# Altium project Safety_2019_V_3_0.PrjPCB
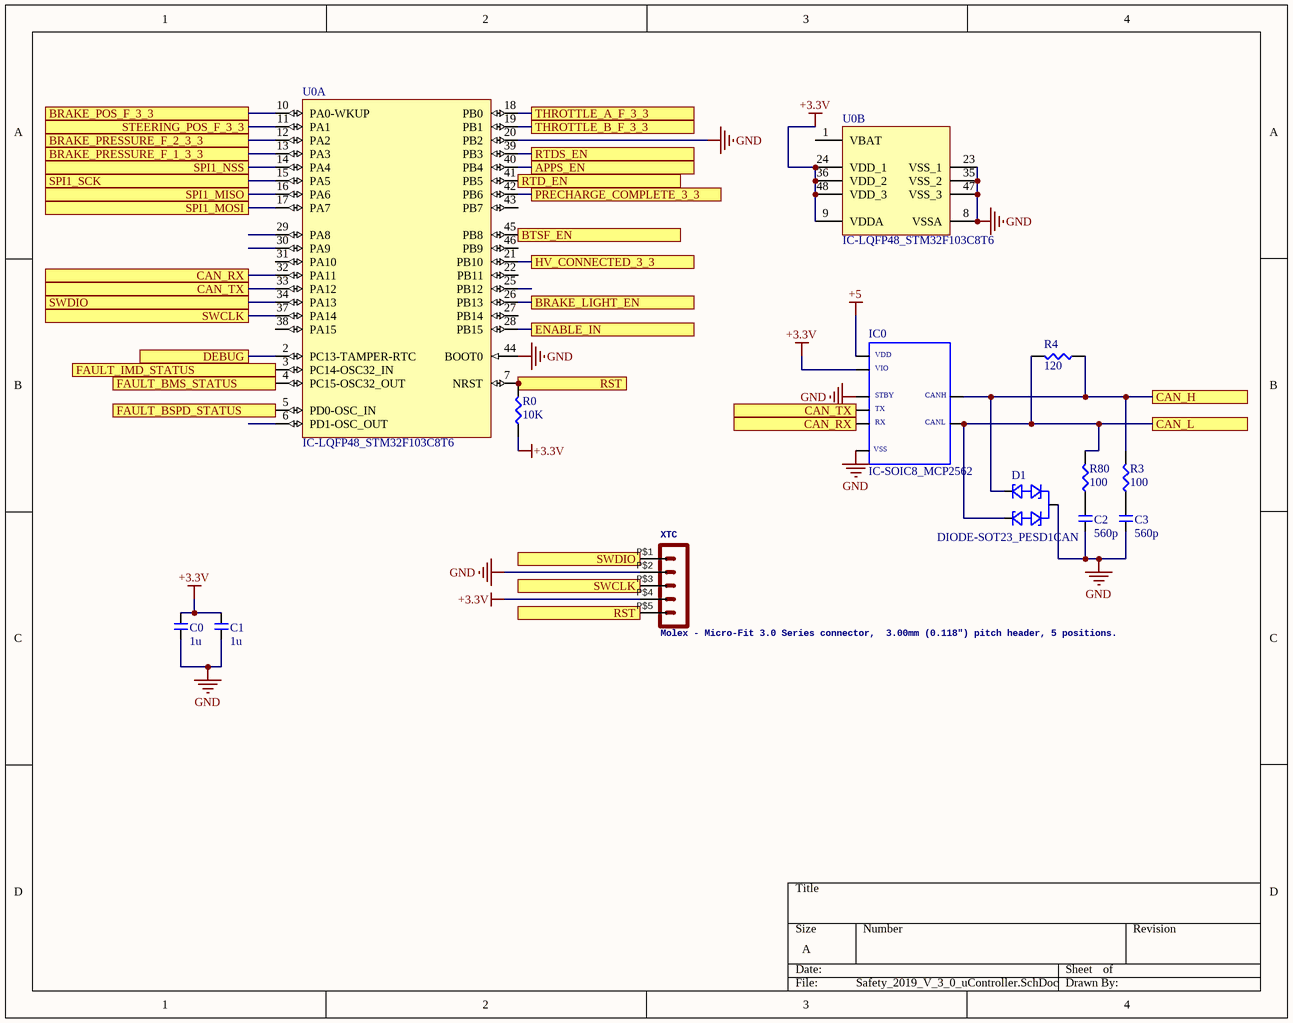
[diagram p0: Safety_2019_V_3_0_uController.SchDoc]
11 sheets, 222 parts. Net scope: flat (ports and power ports of the same name join across sheets).
Board file: SAFETY_2019_v_3_0.PcbDoc
Sheets:
  Safety_2019_V_3_0_uController.SchDoc
  Safety_2019_V_3_0_Faults.SchDoc
  Safety_2019_V_3_0_BSPD.SchDoc
  Safety_2019_V_3_0_BRAKE_LIGHT.SchDoc
  Safety_2019_V_3_0_TSAL.SchDoc
  Safety_2019_V_3_0_Power_IC's.SchDoc
  Safety_2019_V_3_0_Connectors.SchDoc
  Safety_2019_V_3_0_Connector_Filter.SchDoc
  Safety_2019_V_3_0_RTDS.SchDoc
  Safety_2019_V_3_0_Enable.SchDoc
  Safety_2019_V_3_0_TC.SchDoc

## Sheet Safety_2019_V_3_0_uController.SchDoc
size A

### Parts
C0  1u  [CAP-0603]
C1  1u  [CAP-0603]
C2  560p  [CAP-0603]
C3  560p  [CAP-0603]
D1  DIODE-SOT23_PESD1CAN  [SOT23]
IC0  IC-SOIC8_MCP2562  [SOIC8]
R0  10K  [RES-0603]
R3  100  [RES-0603]
R4  120  [RES-0603]
R80  100  [RES-0603]
U0  IC-LQFP48_STM32F103C8T6  [STM-LQFP48_M]  (parts A,B of 2)
XTC  Molex - Micro-Fit 3.0 Series connector,  3.00mm (0.118") pitch header, 5 positions.  [POS5_254MM_MALE]

### Ports
APPS_EN, BRAKE_LIGHT_EN, BRAKE_POS_F_3_3, BRAKE_PRESSURE_F_1_3_3, BRAKE_PRESSURE_F_2_3_3, BTSF_EN, CAN_H, CAN_L, CAN_RX, CAN_TX, DEBUG, ENABLE_IN, FAULT_BMS_STATUS, FAULT_BSPD_STATUS, FAULT_IMD_STATUS, HV_CONNECTED_3_3, PRECHARGE_COMPLETE_3_3, RST, RTD_EN, RTDS_EN, SPI1_MISO, SPI1_MOSI, SPI1_NSS, SPI1_SCK, STEERING_POS_F_3_3, SWCLK, SWDIO, THROTTLE_A_F_3_3, THROTTLE_B_F_3_3

### Nets
+3.3V: C0.2 C1.2 IC0.5 R0.1 U0.9(VDDA) U0.24(VDD_1) U0.36(VDD_2) U0.48(VDD_3) XTC.P$4
+5: IC0.3
GND: C0.1 C1.1 C2.1 C3.1 D1.3(G) IC0.2 IC0.8 U0.8(VSSA) U0.20(PB2) U0.23(VSS_1) U0.35(VSS_2) U0.44(BOOT0) U0.47(VSS_3) XTC.P$2
APPS_EN: U0.40(PB4) ; port APPS_EN
BRAKE_LIGHT_EN: U0.26(PB13) ; port BRAKE_LIGHT_EN
BRAKE_POS_F_3_3: U0.10(PA0-WKUP) ; port BRAKE_POS_F_3_3
BRAKE_PRESSURE_F_1_3_3: U0.13(PA3) ; port BRAKE_PRESSURE_F_1_3_3
BRAKE_PRESSURE_F_2_3_3: U0.12(PA2) ; port BRAKE_PRESSURE_F_2_3_3
BTSF_EN: U0.45(PB8) ; port BTSF_EN
CAN_H: D1.1(CAN1) IC0.7 R3.2 R4.1 ; port CAN_H
CAN_L: D1.2(CAN2) IC0.6 R4.2 R80.2 ; port CAN_L
CAN_RX: IC0.4 U0.32(PA11) ; port CAN_RX
CAN_TX: IC0.1 U0.33(PA12) ; port CAN_TX
DEBUG: U0.2(PC13-TAMPER-RTC) ; port DEBUG
ENABLE_IN: U0.28(PB15) ; port ENABLE_IN
FAULT_BMS_STATUS: U0.4(PC15-OSC32_OUT) ; port FAULT_BMS_STATUS
FAULT_BSPD_STATUS: U0.5(PD0-OSC_IN) ; port FAULT_BSPD_STATUS
FAULT_IMD_STATUS: U0.3(PC14-OSC32_IN) ; port FAULT_IMD_STATUS
HV_CONNECTED_3_3: U0.21(PB10) ; port HV_CONNECTED_3_3
PRECHARGE_COMPLETE_3_3: U0.42(PB6) ; port PRECHARGE_COMPLETE_3_3
RST: R0.2 U0.7(NRST) XTC.P$5 ; port RST
RTD_EN: U0.41(PB5) ; port RTD_EN
RTDS_EN: U0.39(PB3) ; port RTDS_EN
SPI1_MISO: U0.16(PA6) ; port SPI1_MISO
SPI1_MOSI: U0.17(PA7) ; port SPI1_MOSI
SPI1_NSS: U0.14(PA4) ; port SPI1_NSS
SPI1_SCK: U0.15(PA5) ; port SPI1_SCK
STEERING_POS_F_3_3: U0.11(PA1) ; port STEERING_POS_F_3_3
SWCLK: U0.37(PA14) XTC.P$3 ; port SWCLK
SWDIO: U0.34(PA13) XTC.P$1 ; port SWDIO
THROTTLE_A_F_3_3: U0.18(PB0) ; port THROTTLE_A_F_3_3
THROTTLE_B_F_3_3: U0.19(PB1) ; port THROTTLE_B_F_3_3
NetC2_2: C2.2 R80.1
NetC3_2: C3.2 R3.1

Not connected (* = marked no-connect by the designer): U0 1(VBAT) 6(PD1-OSC_OUT) 22(PB11) 25(PB12) 27(PB14) 29(PA8) 30(PA9) 31(PA10) 38(PA15) 43(PB7) 46(PB9)

### Notes on the sheet
- (in symbol IC-SOIC8_MCP2562) VDD; VIO; STBY; CANH; TX; RX; CANL; VSS

### Library data of the parts
C0-C3 = CAP-0603
R0 R3 R4 R80 = RES-0603
U0 = IC-LQFP48_STM32F103C8T6: A/D Converter: 2x12-bit (10 Channel); Core: ARM Cortex-M3; FLASH Size (Prog) (kB): 64; I/Os (High Current): 37; Internal RAM Size (kB): 20; Operating Frequency(F) (Processor speed) (MHz): 72; Packing: Tray; Supply Voltage(Vcc) min (V): 2; DatasheetVersion: Rev. 16; PackageVersion: Rev. 6, 06/2013; PackageReference: LQFP48; PackageDescription: 48-Pin Low Profile Quad Flat Package, 7 x 7 mm Body, 0.5 mm Pitch; Supplier 1: Digi-Key; Supplier Part Number 1: 497-6063-ND; Supplier 2: Farnell; Supplier Part Number 2: 1447637; Supplier 3: Newark; Supplier Part Number 3: 59M2182; Supplier 4: Newark; Supplier Part Number 4: 57P1222; Supplier 5: Mouser; Supplier Part Number 5: 511-STM32F103C8T6; Mounting Technology: Surface Mount; PartNumber: STM32F103C8T6; ComponentLink1Description: Manufacturer URL; ComponentLink1URL: http://www.st.com/web/en/home.html; ComponentLink2Description: Datasheet; ComponentLink2URL: http://www.st.com/st-web-ui/static/active/en/resource/technical/document/datasheet/CD00161566.pdf; ComponentLink3Description: Package Specification; ComponentLink3URL: http://www.st.com/st-web-ui/static/active/en/resource/technical/document/datasheet/DM00058181.pdf
XTC = POS5_254MM_MALE: GateName_1: G$1; SymbolName_1: HEADER_POS5; DeviceName: 43650-0524; DeviceSetName: HEADER_POS5_?; LibraryName: MOLEX Micro-Fit; Package: 43650-0524

## Sheet Safety_2019_V_3_0_Faults.SchDoc
size A
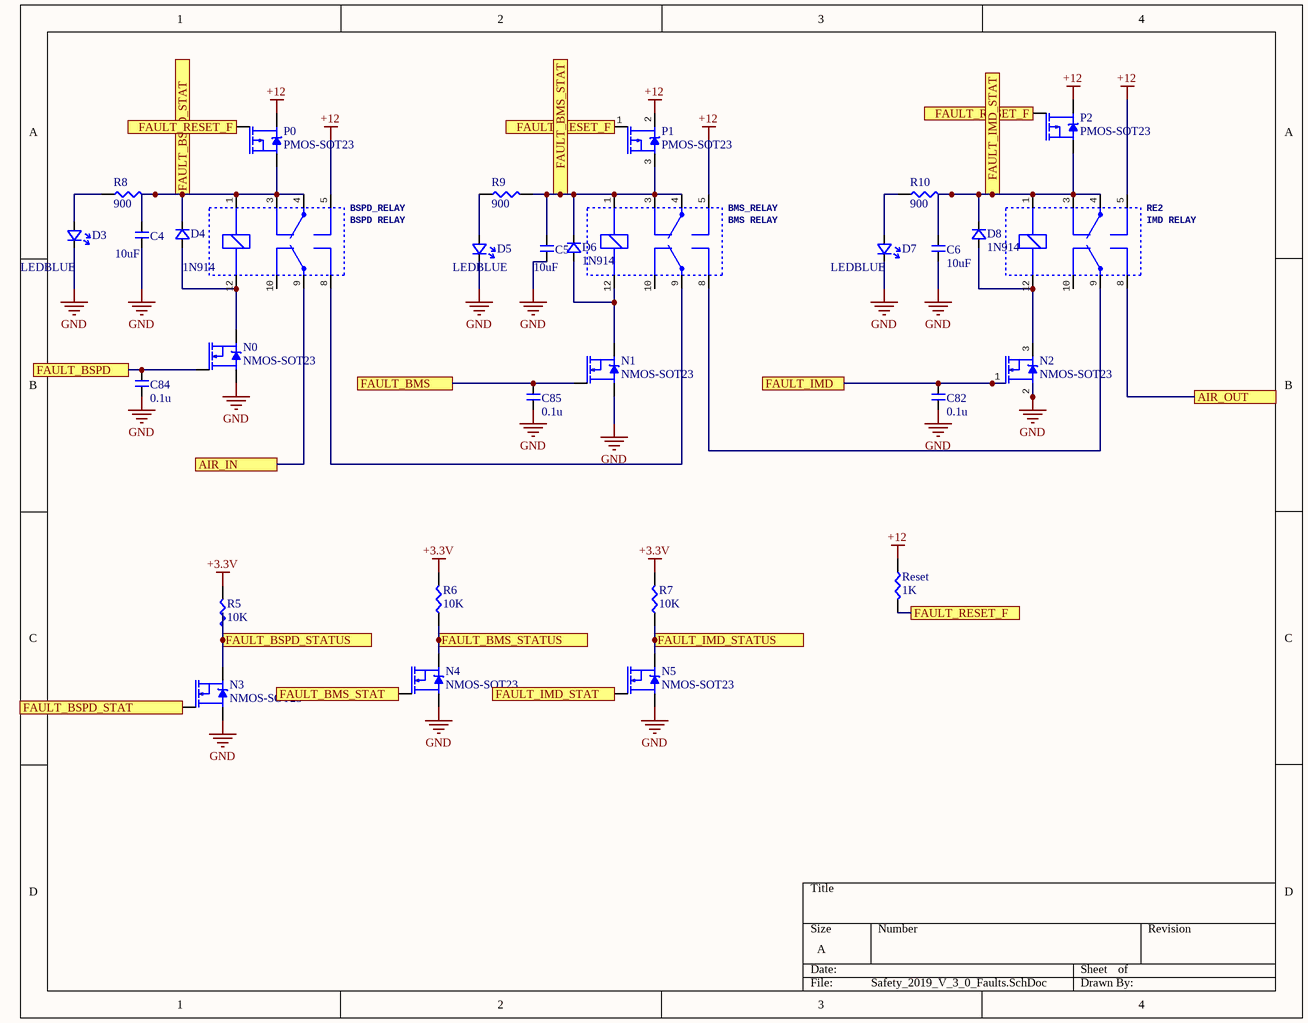
[diagram p1: Safety_2019_V_3_0_Faults.SchDoc]

### Parts
BMS_RELAY  BMS RELAY  [RELAY-DPDT_EC2]
BSPD_RELAY  BSPD RELAY  [RELAY-DPDT_EC2]
C4  10uF  [CAP-0603]
C5  10uF  [CAP-0603]
C6  10uF  [CAP-0603]
C82  0.1u  [CAP-0603]
C84  0.1u  [CAP-0603]
C85  0.1u  [CAP-0603]
D3  LEDBLUE  [LEDBLUE-0603]
D4  1N914  [DO41-10]
D5  LEDBLUE  [LEDBLUE-0603]
D6  1N914  [DO41-10]
D7  LEDBLUE  [LEDBLUE-0603]
D8  1N914  [DO41-10]
N0  NMOS-SOT23  [SOT23]
N1  NMOS-SOT23  [SOT23]
N2  NMOS-SOT23  [SOT23]
N3  NMOS-SOT23  [SOT23]
N4  NMOS-SOT23  [SOT23]
N5  NMOS-SOT23  [SOT23]
P0  PMOS-SOT23  [SOT23]
P1  PMOS-SOT23  [SOT23]
P2  PMOS-SOT23  [SOT23]
R5  10K  [RES-0603]
R6  10K  [RES-0603]
R7  10K  [RES-0603]
R8  900  [RES-0603]
R9  900  [RES-0603]
R10  900  [RES-0603]
RE2  IMD RELAY  [RELAY-DPDT_EC2]
Reset  1K  [RES-0603]

### Ports
AIR_IN, AIR_OUT, FAULT_BMS, FAULT_BMS_STAT, FAULT_BMS_STATUS, FAULT_BSPD, FAULT_BSPD_STAT, FAULT_BSPD_STATUS, FAULT_IMD, FAULT_IMD_STAT, FAULT_IMD_STATUS, FAULT_RESET_F

### Nets
+3.3V: R5.2 R6.2 R7.2
+12: BMS_RELAY.5 BSPD_RELAY.5 P0.2(S) P1.2(S) P2.2(S) RE2.5 Reset.1
GND: C4.2 C5.2 C6.2 C82.1 C84.1 C85.1 D3.K D5.K D7.K N0.2(S) N1.2(S) N2.2(S) N3.2(S) N4.2(S) N5.2(S)
AIR_IN: BSPD_RELAY.9 ; port AIR_IN
AIR_OUT: RE2.8 ; port AIR_OUT
FAULT_BMS: C85.2 N1.1(G) ; port FAULT_BMS
FAULT_BMS_STAT: BMS_RELAY.1 BMS_RELAY.3 BMS_RELAY.4 C5.1 D6.K N4.1(G) P1.3(D) R9.2 ; port FAULT_BMS_STAT
FAULT_BMS_STATUS: N4.3(D) R6.1 ; port FAULT_BMS_STATUS
FAULT_BSPD: C84.2 N0.1(G) ; port FAULT_BSPD
FAULT_BSPD_STAT: BSPD_RELAY.1 BSPD_RELAY.3 BSPD_RELAY.4 C4.1 D4.K N3.1(G) P0.3(D) R8.2 ; port FAULT_BSPD_STAT
FAULT_BSPD_STATUS: N3.3(D) R5.1 ; port FAULT_BSPD_STATUS
FAULT_IMD: C82.2 N2.1(G) ; port FAULT_IMD
FAULT_IMD_STAT: C6.1 D8.K N5.1(G) P2.3(D) R10.2 RE2.1 RE2.3 RE2.4 ; port FAULT_IMD_STAT
FAULT_IMD_STATUS: N5.3(D) R7.1 ; port FAULT_IMD_STATUS
FAULT_RESET_F: P0.1(G) P1.1(G) P2.1(G) Reset.2 ; port FAULT_RESET_F
NetBMS_RELAY_8: BMS_RELAY.8 RE2.9
NetBMS_RELAY_9: BMS_RELAY.9 BSPD_RELAY.8
NetBMS_RELAY_12: BMS_RELAY.12 D6.A N1.3(D)
NetBSPD_RELAY_12: BSPD_RELAY.12 D4.A N0.3(D)
NetD3_A: D3.A R8.1
NetD5_A: D5.A R9.1
NetD7_A: D7.A R10.1
NetD8_A: D8.A N2.3(D) RE2.12

Not connected (* = marked no-connect by the designer): BMS_RELAY 10; BSPD_RELAY 10; RE2 10

### Library data of the parts
BMS_RELAY BSPD_RELAY RE2 = RELAY_EC2: GateName_1: G$1; SymbolName_1: MONOSTABLERELAY; DeviceSetName: EC2; LibraryName: KEMET; Package: DPDT_2.54
C4-C6 C82 C84 C85 = CAP-0603
D3 D5 D7 = LEDBLUE-0603
D4 D6 D8 = DIODE-DO41-10
R5-R10 Reset = RES-0603

## Sheet Safety_2019_V_3_0_BSPD.SchDoc
size A
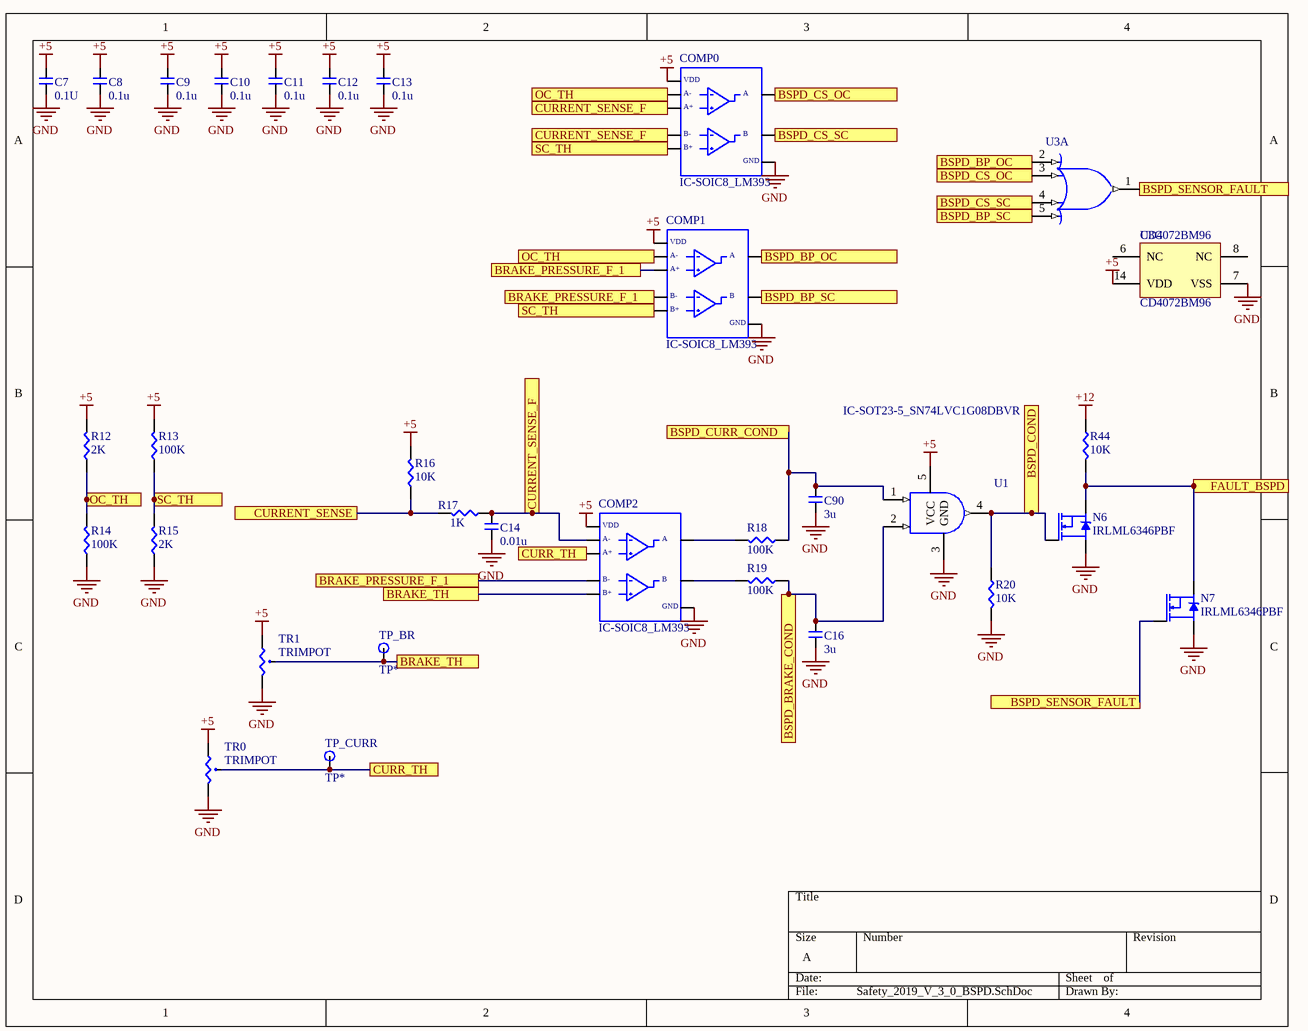
[diagram p2: Safety_2019_V_3_0_BSPD.SchDoc]

### Parts
C7  0.1U  [CAP-0603]
C8  0.1u  [CAP-0603]
C9  0.1u  [CAP-0603]
C10  0.1u  [CAP-0603]
C11  0.1u  [CAP-0603]
C12  0.1u  [CAP-0603]
C13  0.1u  [CAP-0603]
C14  0.01u  [CAP-0603]
C16  3u  [CAP-0603]
C90  3u  [CAP-0603]
COMP0  IC-SOIC8_LM393  [SOIC8]
COMP1  IC-SOIC8_LM393  [SOIC8]
COMP2  IC-SOIC8_LM393  [SOIC8]
N6  IRLML6346PBF  [SOT23]
N7  IRLML6346PBF  [SOT23]
R12  2K  [RES-0603]
R13  100K  [RES-0603]
R14  100K  [RES-0603]
R15  2K  [RES-0603]
R16  10K  [RES-0603]
R17  1K  [RES-0603]
R18  100K  [RES-0603]
R19  100K  [RES-0603]
R20  10K  [RES-0603]
R44  10K  [RES-0603]
TP_BR  TP*  [Testpoint]
TP_CURR  TP*  [Testpoint]
TR0  TRIMPOT  [TRIMPOT_PV36W]
TR1  TRIMPOT  [TRIMPOT_PV36W]
U1  IC-SOT23-5_SN74LVC1G08DBVR  [SOT95P280X110-5N]
U3  CD4072BM96  [SOIC127P600X175-14N]  (parts A,C of 3)

### Ports
BRAKE_PRESSURE_F_1, BRAKE_TH, BSPD_BP_OC, BSPD_BP_SC, BSPD_BRAKE_COND, BSPD_COND, BSPD_CS_OC, BSPD_CS_SC, BSPD_CURR_COND, BSPD_SENSOR_FAULT, CURR_TH, CURRENT_SENSE, CURRENT_SENSE_F, FAULT_BSPD, OC_TH, SC_TH

### Nets
+5: C7.2 C8.2 C9.2 C10.2 C11.2 C12.2 C13.2 COMP0.8 COMP1.8 COMP2.8 R12.2 R13.2 R16.2 TR0.1 TR1.1 U1.5(VCC) U3.14(VDD)
+12: R44.1
GND: C7.1 C8.1 C9.1 C10.1 C11.1 C12.1 C13.1 C14.1 C16.1 C90.1 COMP0.4 COMP1.4 COMP2.4 N6.2(S) N7.2(S) R14.1 R15.1 R20.2 TR0.3 TR1.3 U1.3(GND) U3.7(VSS)
BRAKE_PRESSURE_F_1: COMP1.3 COMP1.6 COMP2.6 ; port BRAKE_PRESSURE_F_1
BRAKE_TH: COMP2.5 TP_BR.1 TR1.2 ; port BRAKE_TH
BSPD_BP_OC: COMP1.1 U3.2(A) ; port BSPD_BP_OC
BSPD_BP_SC: COMP1.7 U3.5(D) ; port BSPD_BP_SC
BSPD_BRAKE_COND: C16.2 R19.1 U1.2(B) ; port BSPD_BRAKE_COND
BSPD_COND: N6.1(G) R20.1 U1.4(Y) ; port BSPD_COND
BSPD_CS_OC: COMP0.1 U3.3(B) ; port BSPD_CS_OC
BSPD_CS_SC: COMP0.7 U3.4(C) ; port BSPD_CS_SC
BSPD_CURR_COND: C90.2 R18.1 U1.1(A) ; port BSPD_CURR_COND
BSPD_SENSOR_FAULT: N7.1(G) U3.1(J) ; port BSPD_SENSOR_FAULT
CURR_TH: COMP2.3 TP_CURR.1 TR0.2 ; port CURR_TH
CURRENT_SENSE: R16.1 R17.2 ; port CURRENT_SENSE
CURRENT_SENSE_F: C14.2 COMP0.3 COMP0.6 COMP2.2 R17.1 ; port CURRENT_SENSE_F
FAULT_BSPD: N6.3(D) N7.3(D) R44.2 ; port FAULT_BSPD
OC_TH: COMP0.2 COMP1.2 R12.1 R14.2 ; port OC_TH
SC_TH: COMP0.5 COMP1.5 R13.1 R15.2 ; port SC_TH
NetCOMP2_1: COMP2.1 R18.2
NetCOMP2_7: COMP2.7 R19.2

Not connected (* = marked no-connect by the designer): U3 6(NC) 8(NC)

### Notes on the sheet
- (in symbol IC-SOIC8_LM393) VDD; A-; A; A+; B-; B; B+; GND

### Library data of the parts
C7-C14 C16 C90 = CAP-0603
N6 N7 = NMOS-SOT23
R12-R20 R44 = RES-0603
TP_BR TP_CURR = Testpoint
TR0 TR1 = TRIMPOT_PV36W
U1 = IC-SOT23-5_SN74LVC1G08DBVR: IC GATE AND 1CH 2-INP SOT23-5; Manufacturer: Texas Instruments; Min Supply Voltage: 1.65V; Max Supply Voltage: 5.5V; Number of Inputs: 2; Propagation Delay: 4ns; Number of Circuits: 1; Quiescent Current: 10uA; High Level Output Current: -32mA; Low Level Output Current: 32mA; Turn-On Delay Time: 4.5ns; Supplier 1: Digi-Key; Manufacturer Part Number: SN74LVC1G08DBVR; Stock 1: 245825; Pricing 1: 1 = 0.43000, 10 = 0.32000, 100 = 0.19960, 500 = 0.13658, 1000 = 0.10506 (USD); RoHS: Yes; Mount: Surface Mount; Case/Package: SOT-23; Number of Pins: 5; Weight: 0.000557oz; Contact Plating: Gold; Min Operating Temperature: -40°C; Max Operating Temperature: 125°C; Packaging: Tape and Reel; Logic Function: AND; Package Quantity: 1; Number of Gates: 1; Number of Outputs: 1; Number of Input Lines: 2; Number of Elements: 1; Number of Output Lines: 1; Number of Bits: 1; Output Current: 32mA; Max Output Current: 32mA; Termination: SMD/SMT; Radiation Hardening: No; Lead Free: Lead Free; REACH SVHC: No SVHC; ComponentLink1URL: http://www.jameco.com/Jameco/Products/ProdDS/756490.pdf?src-supplier=Jameco; ComponentLink1Description: http://www.jameco.com/Jameco/Products/ProdDS/756490.pdf?src-supplier=Jameco; ComponentLink2URL: http://focus.ti.com/lit/ds/symlink/sn74lvc1g08.pdf?src-supplier=Avnet+Europe; ComponentLink2Description: http://focus.ti.com/lit/ds/symlink/sn74lvc1g08.pdf?src-supplier=Avnet+Europe; ComponentLink3URL: http://www.ti.com/general/docs/lit/getliterature.tsp?genericPartNumber=SN74LVC1G08&amp;&amp;fileType=pdf&src-supplier=Avnet+Asia; ComponentLink3Description: http://www.ti.com/general/docs/lit/getliterature.tsp?genericPartNumber=SN74LVC1G08&amp;&amp;fileType=pdf&src-supplier=Avnet+Asia; ComponentLink4URL: http://www.farnell.com/datasheets/1996458.pdf?src-supplier=Element14; ComponentLink4Description: http://www.farnell.com/datasheets/1996458.pdf?src-supplier=Element14; ComponentLink5URL: http://www.ti.com/lit/pdf/sdyu001?src-supplier=Digi-Key; ComponentLink5Description: http://www.ti.com/lit/pdf/sdyu001?src-supplier=Digi-Key; ComponentLink6URL: https://www.verical.com/server-webapp/html/getDatasheet?partID=39173&src-supplier=Verical; ComponentLink6Description: https://www.verical.com/server-webapp/html/getDatasheet?partID=39173&src-supplier=Verical; ComponentLink7URL: http://www.ti.com/general/docs/lit/getliterature.tsp?genericPartNumber=SN74LVC1G08&&fileType=pdf&src-supplier=Avnet; ComponentLink7Description: http://www.ti.com/general/docs/lit/getliterature.tsp?genericPartNumber=SN74LVC1G08&&fileType=pdf&src-supplier=Avnet; ComponentLink8URL: http://www.produktinfo.conrad.com/datenblaetter/1000000-1099999/001074511-da-01-en-IC_2_INPUT_SN74LVC1G08DBVR_SOT_23_5_TID.pdf?src-supplier=Conrad; ComponentLink8Description: http://www.produktinfo.conrad.com/datenblaetter/1000000-1099999/001074511-da-01-en-IC_2_INPUT_SN74LVC1G08DBVR_SOT_23_5_TID.pdf?src-supplier=Conrad
U3 = IC-SOIC14_CD4072BM96: Logic Gates CMOS Dual 4-Input OR; Manufacturer: Texas Instruments; Output Current: 6.8mA; Propagation Delay: 90ns; Max Supply Voltage: 18V; Min Supply Voltage: 3V; Number of Outputs: 1; Number of Inputs: 4; Number of Circuits: 2; Quiescent Current: 5uA; High Level Output Current: 3.4mA; Turn-On Delay Time: 120ns; Supplier 1: Digi-Key; Manufacturer Part Number: CD4072BM96; Stock 1: 5874; Pricing 1: 1 = 0.42000, 10 = 0.35900, 100 = 0.26820, 500 = 0.21074, 1000 = 0.16284 (USD); RoHS: Yes; Mount: Surface Mount; Case/Package: SOIC; Number of Pins: 14; Weight: 0.004564oz; Contact Plating: Gold; Min Operating Temperature: -55°C; Max Operating Temperature: 125°C; Packaging: Tape and Reel; Package Quantity: 1; Logic Function: OR; Low Level Output Current: 3.4mA; Number of Gates: 2; Number of Input Lines: 4; Number of Output Lines: 1; Number of Elements: 2; Number of Bits: 2; Lead Free: Lead Free; REACH SVHC: No SVHC; ComponentLink1URL: http://www.ti.com/general/docs/lit/getliterature.tsp?genericPartNumber=CD4072B-MIL&&fileType=pdf&src-supplier=Avnet; ComponentLink1Description: http://www.ti.com/general/docs/lit/getliterature.tsp?genericPartNumber=CD4072B-MIL&&fileType=pdf&src-supplier=Avnet; ComponentLink2URL: http://www.farnell.com/datasheets/1834701.pdf?src-supplier=Element14; ComponentLink2Description: http://www.farnell.com/datasheets/1834701.pdf?src-supplier=Element14; ComponentLink3URL: http://www.produktinfo.conrad.com/datenblaetter/1000000-1099999/001073543-da-01-en-IC_DUAL_4INPUT_OR_CD4072BM96_SOIC_14_TID.pdf?src-supplier=Conrad; ComponentLink3Description: http://www.produktinfo.conrad.com/datenblaetter/1000000-1099999/001073543-da-01-en-IC_DUAL_4INPUT_OR_CD4072BM96_SOIC_14_TID.pdf?src-supplier=Conrad

## Sheet Safety_2019_V_3_0_BRAKE_LIGHT.SchDoc
size A
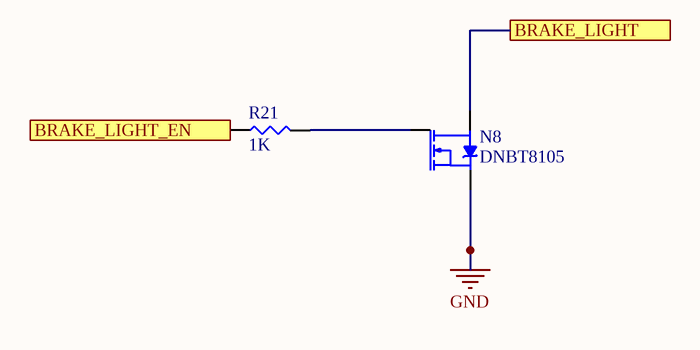
[diagram p3: Safety_2019_V_3_0_BRAKE_LIGHT.SchDoc]

### Parts
N8  DNBT8105  [SOT23]
R21  1K  [RES-0603]

### Ports
BRAKE_LIGHT, BRAKE_LIGHT_EN

### Nets
GND: N8.3(D)
BRAKE_LIGHT: N8.2(S) ; port BRAKE_LIGHT
BRAKE_LIGHT_EN: R21.1 ; port BRAKE_LIGHT_EN
NetN8_1: N8.1(G) R21.2

### Library data of the parts
N8 = NMOS-SOT23
R21 = RES-0603

## Sheet Safety_2019_V_3_0_TSAL.SchDoc
size A
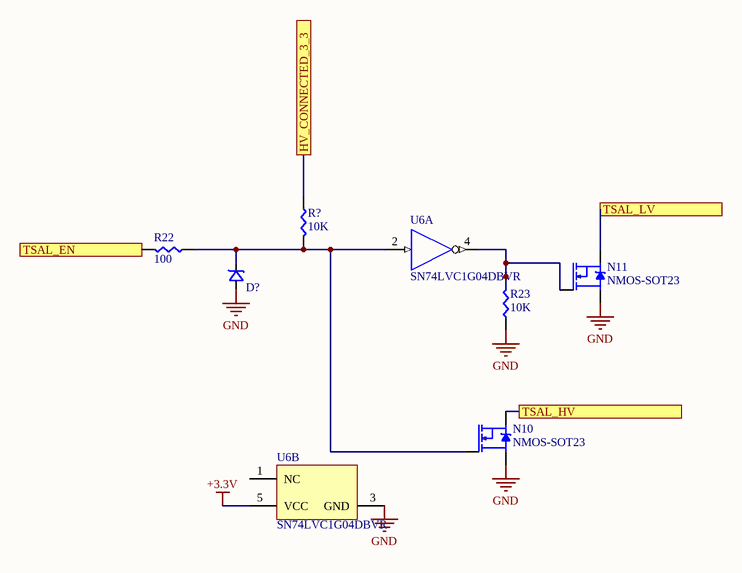
[diagram p4: Safety_2019_V_3_0_TSAL.SchDoc]

### Parts
D?  5.6V  [SMB]  (value not drawn)
N10  NMOS-SOT23  [SOT23]
N11  NMOS-SOT23  [SOT23]
R22  100  [RES-0603]
R23  10K  [RES-0603]
R?  10K  [RES-0603]
U6  SN74LVC1G04DBVR  [DBV0005A_L]  (parts A,B of 2)

### Ports
HV_CONNECTED_3_3, TSAL_EN, TSAL_HV, TSAL_LV

### Nets
+3.3V: U6.5(VCC)
GND: D?.A N10.2(S) N11.2(S) R23.1 U6.3(GND)
HV_CONNECTED_3_3: R?.1 ; port HV_CONNECTED_3_3
TSAL_EN: R22.2 ; port TSAL_EN
TSAL_HV: N10.3(D) ; port TSAL_HV
TSAL_LV: N11.3(D) ; port TSAL_LV
NetD?_K: D?.K N10.1(G) R22.1 R?.2 U6.2(A)
NetN11_1: N11.1(G) R23.2 U6.4(Y)

Not connected (* = marked no-connect by the designer): U6 1(NC)

### Library data of the parts
D? = DIODE-SMB
R22 R23 R? = RES-0603
U6 = CMP-0859-00134-2: Single Inverter, DBV0005A, LARGE T&R; Manufacturer: Texas Instruments; Rating: Catalog; ICC @ Nom Voltage(Max)(mA): 0.01; F @ Nom Voltage(Max)(Mhz): 150; Output Type: CMOS; VCC(Min)(V): 1.65; Technology Family: LVC; 3-State Output: No; tpd @ Nom Voltage(Max)(ns): 7.5,5.2,4.2,3.7; Sub-Family: Inverting Buffer/Driver; Voltage(Nom)(V): 1.8,2.5,3.3,5; Output Drive (IOL/IOH)(Max)(mA): 32/-32; Bits(#): 1; VCC(Max)(V): 5.5; Logic: Inverting; Input Type: CMOS/TTL; PackageReference: DBV0005A; ComponentLink2URL: http://www.ti.com/lit/ds/symlink/sn74lvc1g04.pdf; Schmitt Trigger: No; DatasheetVersion: SCES214AD; Operating Temperature Range(C): -40 to 125,-40 to 85; ComponentLink1URL: http://www.ti.com/; ComponentLink2Description: Datasheet; ComponentLink1Description: Manufacturer URL; PartNumber: SN74LVC1G04DBVR; Generic Part Number: SN74LVC1G04; PartId: 1

## Sheet Safety_2019_V_3_0_Power_IC's.SchDoc
size A
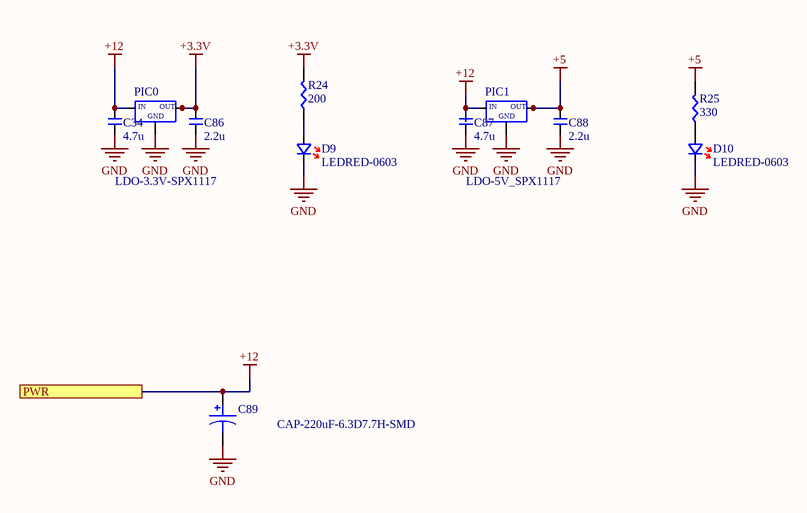
[diagram p5: Safety_2019_V_3_0_Power_IC's.SchDoc]

### Parts
C34  4.7u  [CAP-0603]
C86  2.2u  [CAP-0603]
C87  4.7u  [CAP-0603]
C88  2.2u  [CAP-0603]
C89  CAP-220uF-6.3D7.7H-SMD  [CAP-6.3D7.7H-SMD]
D9  LEDRED-0603  [LEDRED-0603]
D10  LEDRED-0603  [LEDRED-0603]
PIC0  LDO-3.3V-SPX1117  [SOT223]
PIC1  LDO-5V_SPX1117  [SOT223]
R24  200  [RES-0603]
R25  330  [RES-0603]

### Ports
PWR

### Nets
+3.3V: C86.2 PIC0.2 PIC0.4 R24.2
+5: C88.2 PIC1.2 PIC1.4 R25.2
+12: C34.2 C87.2 C89.POS(+) PIC0.3 PIC1.3 ; port PWR
GND: C34.1 C86.1 C87.1 C88.1 C89.NEG(-) D9.K D10.K PIC0.1 PIC1.1
NetD9_A: D9.A R24.1
NetD10_A: D10.A R25.1

### Notes on the sheet
- (in symbol LDO-SOT223_SPX1117) IN; OUT; GND

### Library data of the parts
C34 C86-C88 = CAP-0603
C89 = CAP-6.3D7.7H-SMD
PIC0 PIC1 = LDO-SOT223_SPX1117
R24 R25 = RES-0603

## Sheet Safety_2019_V_3_0_Connectors.SchDoc
size A
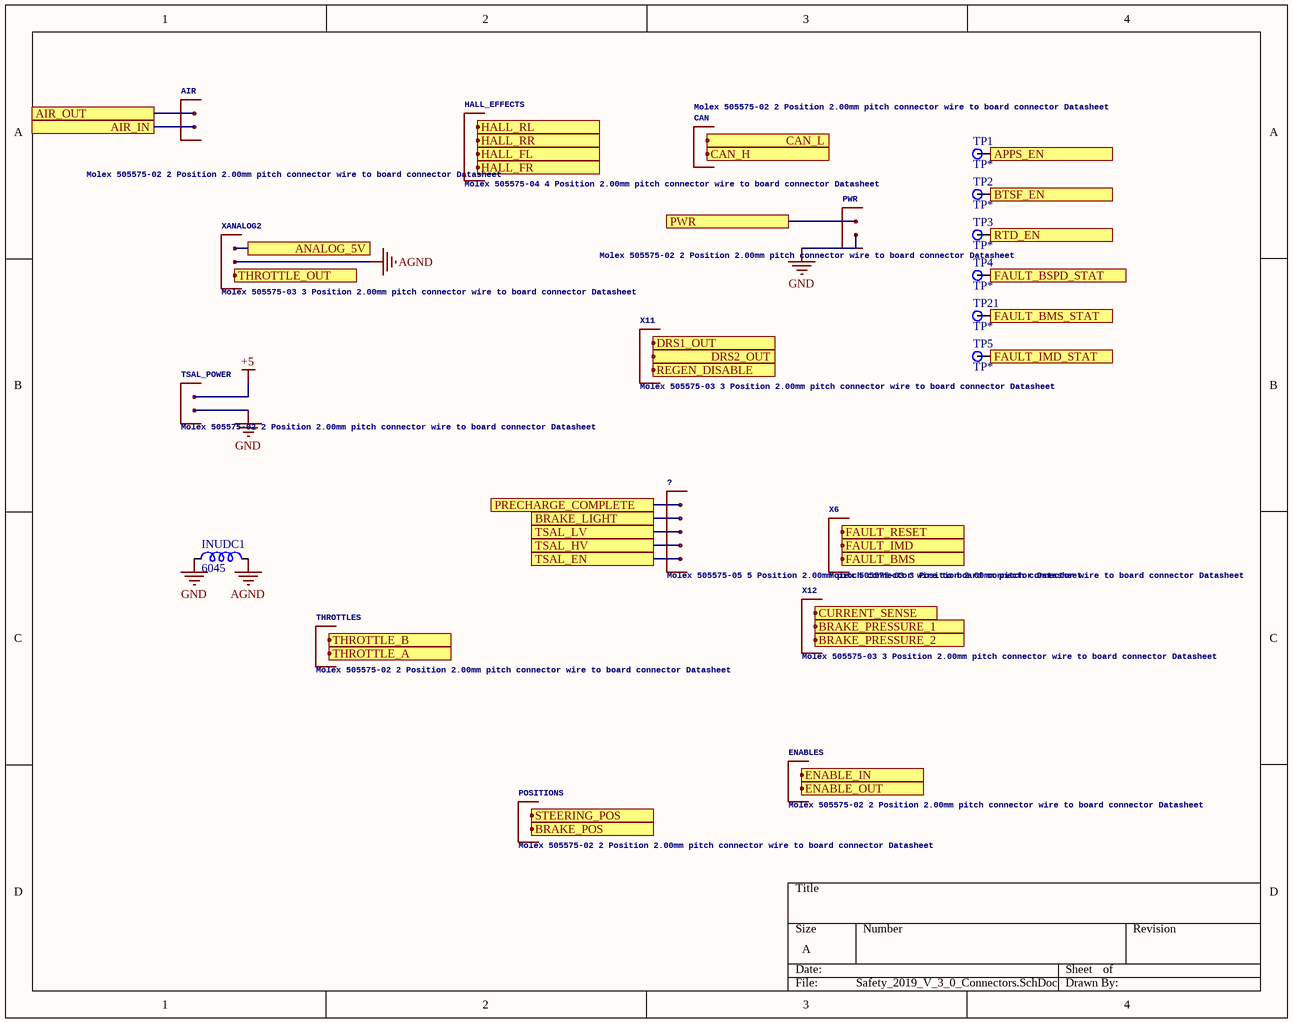
[diagram p6: Safety_2019_V_3_0_Connectors.SchDoc]

### Parts
?  Molex 505575-05 5 Position 2.00mm pitch connector wire to board connector Datasheet  [505575-05]
AIR  Molex 505575-02 2 Position 2.00mm pitch connector wire to board connector Datasheet  [505575-02]
CAN  Molex 505575-02 2 Position 2.00mm pitch connector wire to board connector Datasheet  [505575-02]
ENABLES  Molex 505575-02 2 Position 2.00mm pitch connector wire to board connector Datasheet  [505575-02]
HALL_EFFECTS  Molex 505575-04 4 Position 2.00mm pitch connector wire to board connector Datasheet  [505575-04]
INUDC1  6045  [IND-6045]
POSITIONS  Molex 505575-02 2 Position 2.00mm pitch connector wire to board connector Datasheet  [505575-02]
PWR  Molex 505575-02 2 Position 2.00mm pitch connector wire to board connector Datasheet  [505575-02]
THROTTLES  Molex 505575-02 2 Position 2.00mm pitch connector wire to board connector Datasheet  [505575-02]
TP1  TP*  [Testpoint]
TP2  TP*  [Testpoint]
TP3  TP*  [Testpoint]
TP4  TP*  [Testpoint]
TP5  TP*  [Testpoint]
TP21  TP*  [Testpoint]
TSAL_POWER  Molex 505575-02 2 Position 2.00mm pitch connector wire to board connector Datasheet  [505575-02]
X6  Molex 505575-03 3 Position 2.00mm pitch connector wire to board connector Datasheet  [505575-03]
X11  Molex 505575-03 3 Position 2.00mm pitch connector wire to board connector Datasheet  [505575-03]
X12  Molex 505575-03 3 Position 2.00mm pitch connector wire to board connector Datasheet  [505575-03]
XANALOG2  Molex 505575-03 3 Position 2.00mm pitch connector wire to board connector Datasheet  [505575-03]

### Ports
AIR_IN, AIR_OUT, ANALOG_5V, APPS_EN, BRAKE_LIGHT, BRAKE_POS, BRAKE_PRESSURE_1, BRAKE_PRESSURE_2, BTSF_EN, CAN_H, CAN_L, CURRENT_SENSE, DRS1_OUT, DRS2_OUT, ENABLE_IN, ENABLE_OUT, FAULT_BMS, FAULT_BMS_STAT, FAULT_BSPD_STAT, FAULT_IMD, FAULT_IMD_STAT, FAULT_RESET, HALL_FL, HALL_FR, HALL_RL, HALL_RR, PRECHARGE_COMPLETE, PWR, REGEN_DISABLE, RTD_EN, STEERING_POS, THROTTLE_A, THROTTLE_B, THROTTLE_OUT, TSAL_EN, TSAL_HV, TSAL_LV

### Nets
+5: TSAL_POWER.1
+12: PWR.1 ; port PWR
AGND: INUDC1.2 XANALOG2.2
GND: INUDC1.1 PWR.2 TSAL_POWER.2
AIR_IN: AIR.2 ; port AIR_IN
AIR_OUT: AIR.1 ; port AIR_OUT
ANALOG_5V: XANALOG2.1 ; port ANALOG_5V
APPS_EN: TP1.1 ; port APPS_EN
BRAKE_LIGHT: ?.2 ; port BRAKE_LIGHT
BRAKE_POS: POSITIONS.2 ; port BRAKE_POS
BRAKE_PRESSURE_1: X12.2 ; port BRAKE_PRESSURE_1
BRAKE_PRESSURE_2: X12.3 ; port BRAKE_PRESSURE_2
BTSF_EN: TP2.1 ; port BTSF_EN
CAN_H: CAN.2 ; port CAN_H
CAN_L: CAN.1 ; port CAN_L
CURRENT_SENSE: X12.1 ; port CURRENT_SENSE
DRS1_OUT: X11.1 ; port DRS1_OUT
DRS2_OUT: X11.2 ; port DRS2_OUT
ENABLE_IN: ENABLES.1 ; port ENABLE_IN
ENABLE_OUT: ENABLES.2 ; port ENABLE_OUT
FAULT_BMS: X6.3 ; port FAULT_BMS
FAULT_BMS_STAT: TP21.1 ; port FAULT_BMS_STAT
FAULT_BSPD_STAT: TP4.1 ; port FAULT_BSPD_STAT
FAULT_IMD: X6.2 ; port FAULT_IMD
FAULT_IMD_STAT: TP5.1 ; port FAULT_IMD_STAT
FAULT_RESET: X6.1 ; port FAULT_RESET
HALL_FL: HALL_EFFECTS.3 ; port HALL_FL
HALL_FR: HALL_EFFECTS.4 ; port HALL_FR
HALL_RL: HALL_EFFECTS.1 ; port HALL_RL
HALL_RR: HALL_EFFECTS.2 ; port HALL_RR
PRECHARGE_COMPLETE: ?.1 ; port PRECHARGE_COMPLETE
REGEN_DISABLE: X11.3 ; port REGEN_DISABLE
RTD_EN: TP3.1 ; port RTD_EN
STEERING_POS: POSITIONS.1 ; port STEERING_POS
THROTTLE_A: THROTTLES.2 ; port THROTTLE_A
THROTTLE_B: THROTTLES.1 ; port THROTTLE_B
THROTTLE_OUT: XANALOG2.3 ; port THROTTLE_OUT
TSAL_EN: ?.5 ; port TSAL_EN
TSAL_HV: ?.4 ; port TSAL_HV
TSAL_LV: ?.3 ; port TSAL_LV

### Library data of the parts
? = 505575-05: GateName_1: G$1; SymbolName_1: 5POS; LibraryName: MOLEX Micro-Lock; DeviceSetName: 505575-05; Package: 505575-05
AIR CAN ENABLES POSITIONS PWR THROTTLES TSAL_POWER = 505575-02: GateName_1: G$1; SymbolName_1: 2POS; LibraryName: MOLEX Micro-Lock; DeviceSetName: 505575-02; Package: 505575-02
HALL_EFFECTS = 505575-04: GateName_1: G$1; SymbolName_1: 4POS; LibraryName: MOLEX Micro-Lock; DeviceSetName: 505575-04; Package: 505575-04
INUDC1 = IND-6045
TP1-TP5 TP21 = Testpoint
X6 X11 X12 XANALOG2 = 505575-03: GateName_1: G$1; SymbolName_1: 3POS; LibraryName: MOLEX Micro-Lock; DeviceSetName: 505575-03; Package: 505575-03

## Sheet Safety_2019_V_3_0_Connector_Filter.SchDoc
size B
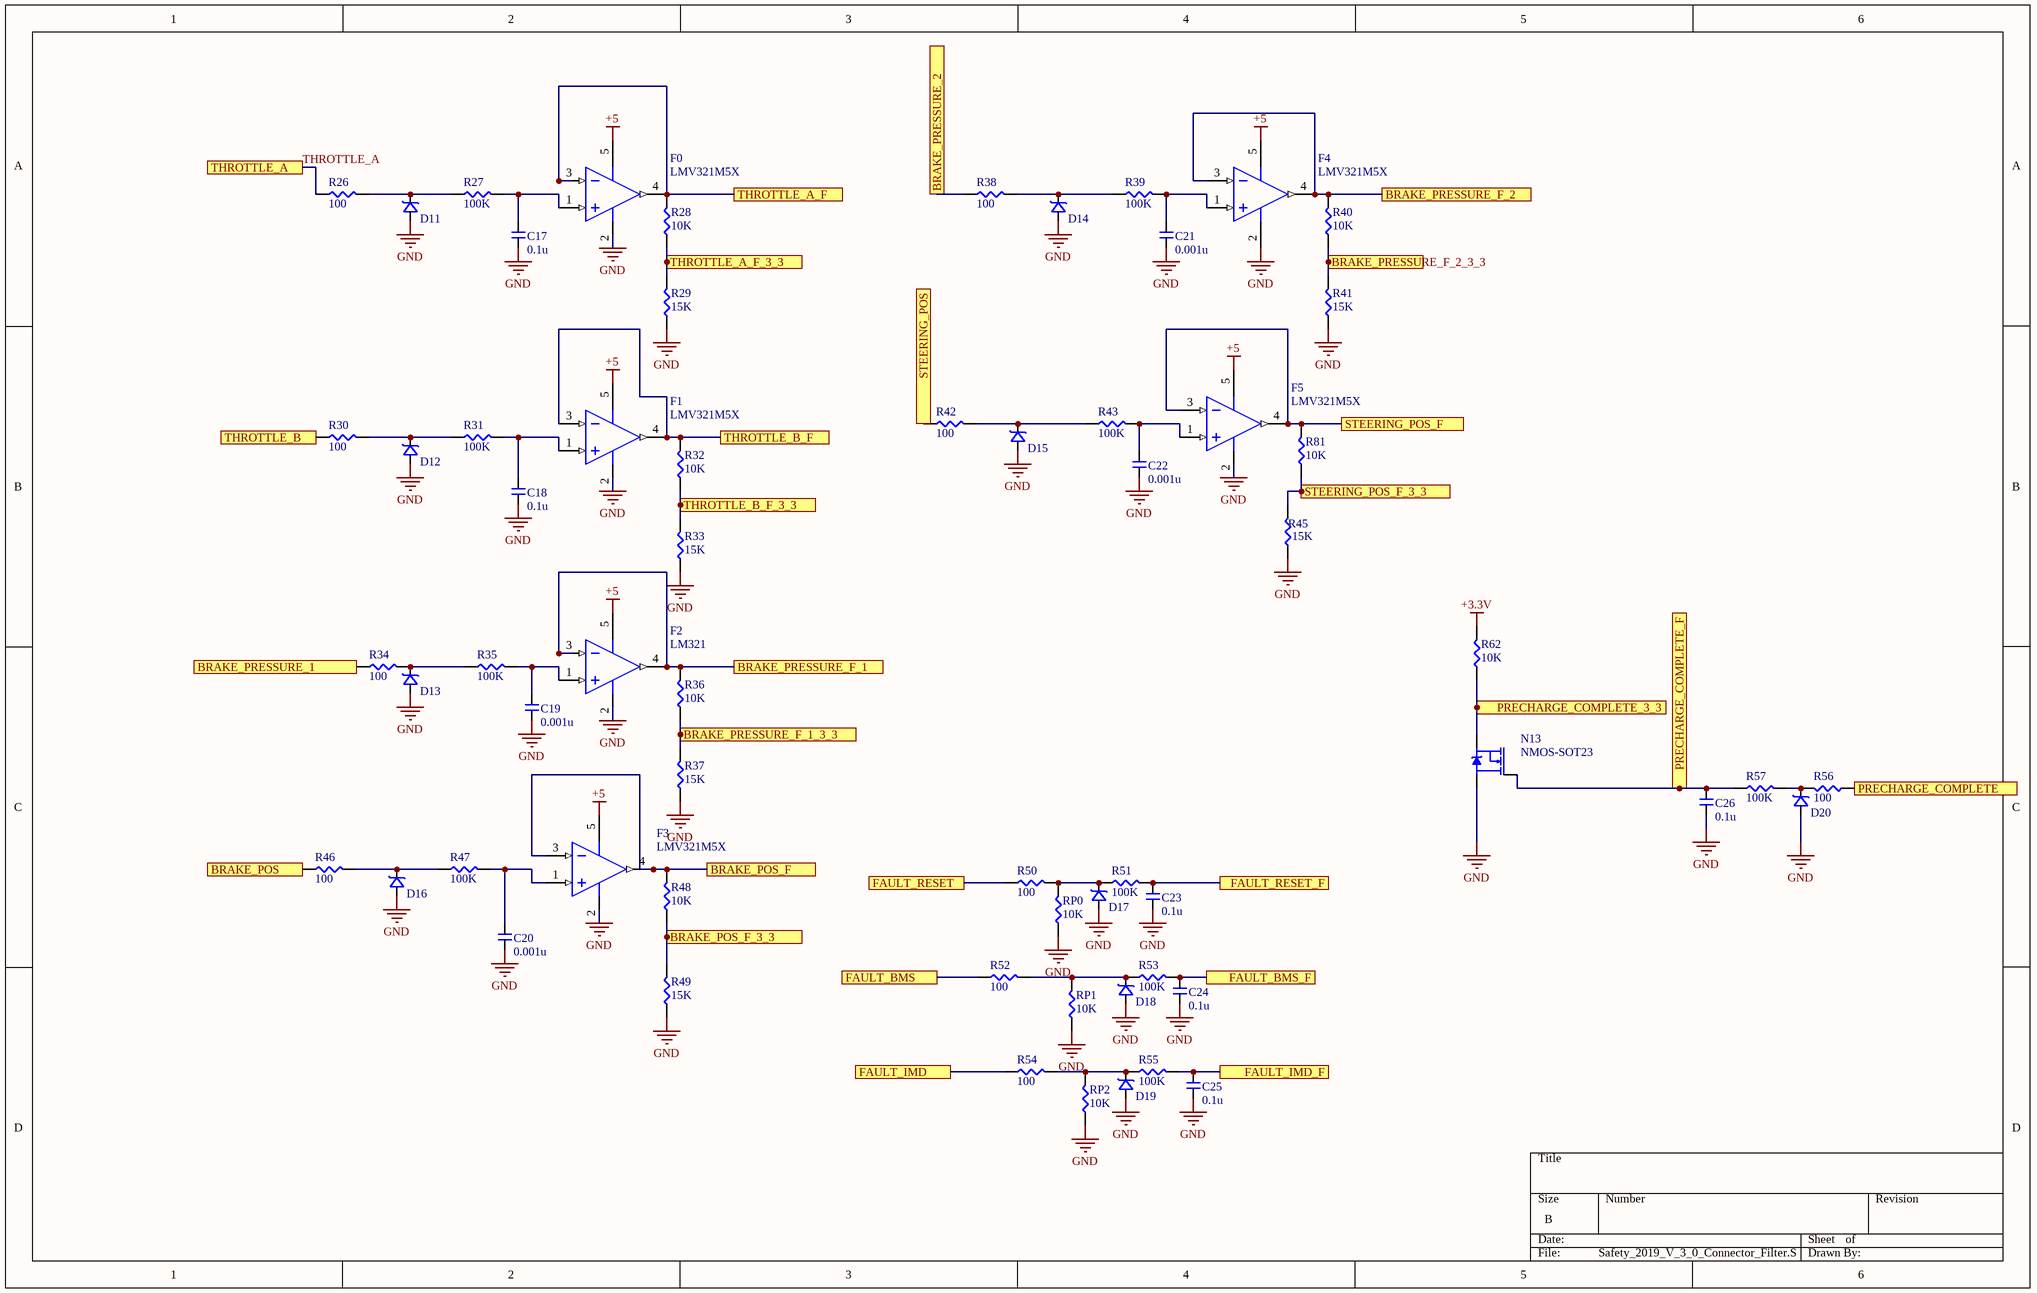
[diagram p7: Safety_2019_V_3_0_Connector_Filter.SchDoc]

### Parts
C17  0.1u  [CAP-0603]
C18  0.1u  [CAP-0603]
C19  0.001u  [CAP-0603]
C20  0.001u  [CAP-0603]
C21  0.001u  [CAP-0603]
C22  0.001u  [CAP-0603]
C23  0.1u  [CAP-0603]
C24  0.1u  [CAP-0603]
C25  0.1u  [CAP-0603]
C26  0.1u  [CAP-0603]
D11  ?  [SMB]  (value not drawn)
D12  ?  [SMB]  (value not drawn)
D13  ?  [SMB]  (value not drawn)
D14  ?  [SMB]  (value not drawn)
D15  ?  [SMB]  (value not drawn)
D16  ?  [SMB]  (value not drawn)
D17  ?  [SMB]  (value not drawn)
D18  ?  [SMB]  (value not drawn)
D19  ?  [SMB]  (value not drawn)
D20  ?  [SMB]  (value not drawn)
F0  LMV321M5X  [MF05A_N]
F1  LMV321M5X  [MF05A_N]
F2  LM321  [MF05A_N]
F3  LMV321M5X  [MF05A_N]
F4  LMV321M5X  [MF05A_N]
F5  LMV321M5X  [MF05A_N]
N13  NMOS-SOT23  [SOT23]
R26  100  [RES-0603]
R27  100K  [RES-0603]
R28  10K  [RES-0603]
R29  15K  [RES-0603]
R30  100  [RES-0603]
R31  100K  [RES-0603]
R32  10K  [RES-0603]
R33  15K  [RES-0603]
R34  100  [RES-0603]
R35  100K  [RES-0603]
R36  10K  [RES-0603]
R37  15K  [RES-0603]
R38  100  [RES-0603]
R39  100K  [RES-0603]
R40  10K  [RES-0603]
R41  15K  [RES-0603]
R42  100  [RES-0603]
R43  100K  [RES-0603]
R45  15K  [RES-0603]
R46  100  [RES-0603]
R47  100K  [RES-0603]
R48  10K  [RES-0603]
R49  15K  [RES-0603]
R50  100  [RES-0603]
R51  100K  [RES-0603]
R52  100  [RES-0603]
R53  100K  [RES-0603]
R54  100  [RES-0603]
R55  100K  [RES-0603]
R56  100  [RES-0603]
R57  100K  [RES-0603]
R62  10K  [RES-0603]
R81  10K  [RES-0603]
RP0  10K  [RES-0603]
RP1  10K  [RES-0603]
RP2  10K  [RES-0603]

### Ports
BRAKE_POS, BRAKE_POS_F, BRAKE_POS_F_3_3, BRAKE_PRESSURE_1, BRAKE_PRESSURE_2, BRAKE_PRESSURE_F_1, BRAKE_PRESSURE_F_1_3_3, BRAKE_PRESSURE_F_2, BRAKE_PRESSURE_F_2_3_3, FAULT_BMS, FAULT_BMS_F, FAULT_IMD, FAULT_IMD_F, FAULT_RESET, FAULT_RESET_F, PRECHARGE_COMPLETE, PRECHARGE_COMPLETE_3_3, PRECHARGE_COMPLETE_F, STEERING_POS, STEERING_POS_F, STEERING_POS_F_3_3, THROTTLE_A, THROTTLE_A_F, THROTTLE_A_F_3_3, THROTTLE_B, THROTTLE_B_F, THROTTLE_B_F_3_3

### Nets
+3.3V: R62.2
+5: F0.5(V+) F1.5(V+) F2.5(V+) F3.5(V+) F4.5(V+) F5.5(V+)
GND: C17.2 C18.2 C19.2 C20.2 C21.2 C22.2 C23.1 C24.1 C25.1 C26.1 D11.A D12.A D13.A D14.A D15.A D16.A D17.A D18.A D19.A D20.A F0.2(V-) F1.2(V-) F2.2(V-) F3.2(V-) F4.2(V-) F5.2(V-) N13.2(S) R29.1 R33.1 R37.1 R41.1 R45.1 R49.1 RP0.1 RP1.1 RP2.1
BRAKE_POS: R46.1 ; port BRAKE_POS
BRAKE_POS_F: F3.3(IN-) F3.4(OUT) R48.2 ; port BRAKE_POS_F
BRAKE_POS_F_3_3: R48.1 R49.2 ; port BRAKE_POS_F_3_3
BRAKE_PRESSURE_1: R34.1 ; port BRAKE_PRESSURE_1
BRAKE_PRESSURE_2: R38.1 ; port BRAKE_PRESSURE_2
BRAKE_PRESSURE_F_1: F2.3(IN-) F2.4(OUT) R36.2 ; port BRAKE_PRESSURE_F_1
BRAKE_PRESSURE_F_1_3_3: R36.1 R37.2 ; port BRAKE_PRESSURE_F_1_3_3
BRAKE_PRESSURE_F_2: F4.3(IN-) F4.4(OUT) R40.2 ; port BRAKE_PRESSURE_F_2
BRAKE_PRESSURE_F_2_3_3: R40.1 R41.2 ; port BRAKE_PRESSURE_F_2_3_3
FAULT_BMS: R52.1 ; port FAULT_BMS
FAULT_BMS_F: C24.2 R53.2 ; port FAULT_BMS_F
FAULT_IMD: R54.1 ; port FAULT_IMD
FAULT_IMD_F: C25.2 R55.2 ; port FAULT_IMD_F
FAULT_RESET: R50.1 ; port FAULT_RESET
FAULT_RESET_F: C23.2 R51.2 ; port FAULT_RESET_F
PRECHARGE_COMPLETE: R56.1 ; port PRECHARGE_COMPLETE
PRECHARGE_COMPLETE_3_3: N13.3(D) R62.1 ; port PRECHARGE_COMPLETE_3_3
PRECHARGE_COMPLETE_F: C26.2 N13.1(G) R57.1 ; port PRECHARGE_COMPLETE_F
STEERING_POS: R42.1 ; port STEERING_POS
STEERING_POS_F: F5.3(IN-) F5.4(OUT) R81.2 ; port STEERING_POS_F
STEERING_POS_F_3_3: R45.2 R81.1 ; port STEERING_POS_F_3_3
THROTTLE_A: R26.1 ; port THROTTLE_A
THROTTLE_A_F: F0.3(IN-) F0.4(OUT) R28.2 ; port THROTTLE_A_F
THROTTLE_A_F_3_3: R28.1 R29.2 ; port THROTTLE_A_F_3_3
THROTTLE_B: R30.1 ; port THROTTLE_B
THROTTLE_B_F: F1.3(IN-) F1.4(OUT) R32.2 ; port THROTTLE_B_F
THROTTLE_B_F_3_3: R32.1 R33.2 ; port THROTTLE_B_F_3_3
NetC17_1: C17.1 F0.1(IN+) R27.2
NetC18_1: C18.1 F1.1(IN+) R31.2
NetC19_1: C19.1 F2.1(IN+) R35.2
NetC20_1: C20.1 F3.1(IN+) R47.2
NetC21_1: C21.1 F4.1(IN+) R39.2
NetC22_1: C22.1 F5.1(IN+) R43.2
NetD11_K: D11.K R26.2 R27.1
NetD12_K: D12.K R30.2 R31.1
NetD13_K: D13.K R34.2 R35.1
NetD14_K: D14.K R38.2 R39.1
NetD15_K: D15.K R42.2 R43.1
NetD16_K: D16.K R46.2 R47.1
NetD17_K: D17.K R50.2 R51.1 RP0.2
NetD18_K: D18.K R52.2 R53.1 RP1.2
NetD19_K: D19.K R54.2 R55.1 RP2.2
NetD20_K: D20.K R56.2 R57.2

### Library data of the parts
C17-C26 = CAP-0603
D11-D20 = DIODE-SMB
F0-F5 = CMP-0055-01048-2: General Purpose, Low Voltage, Rail-to-Rail Output Operational Amplifiers, 5-pin SOT-23; Manufacturer: National Semiconductor; PackageTopMarking: A13*XTT; PowerWise: N; ComponentLink2URL: http://www.national.com/pf/LM/LMV321.html; ComponentLink1Description: LMV321 Datasheet; PackageReference: MF05A; ComponentLink3Description: MF05A Package Page; ComponentLink2Description: LMV321 Web Page; CompType: Amplifiers; ComponentLink1URL: http://www.national.com/ds/LM/LMV321.pdf; ComponentLink3URL: http://www.national.com/packaging/folders/mf05a.html; PinCount: 5; PackageDescription: Molded SOT-23, .115 x .063 x .040 in Body, 5 Lead, .0375 in Pitch; PackageVersion: revD, Aug-2008; RevisionNote: Component URLs added; DatasheetVersion: Sep-2009; RoHS: N
R26-R43 R45-R57 R62 R81 RP0-RP2 = RES-0603

## Sheet Safety_2019_V_3_0_RTDS.SchDoc
size A
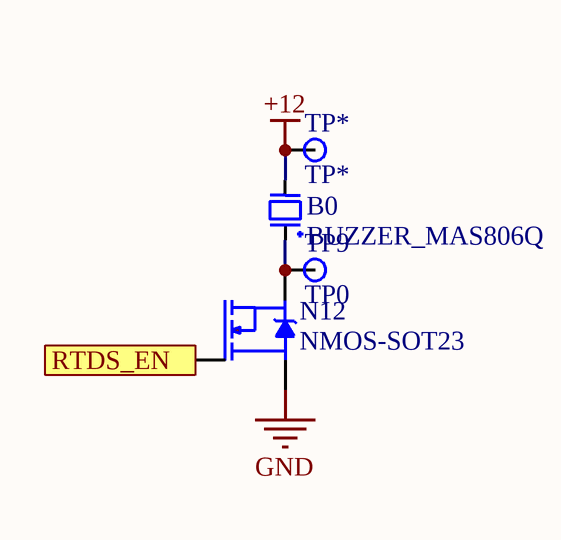
[diagram p8: Safety_2019_V_3_0_RTDS.SchDoc]

### Parts
B0  BUZZER_MAS806Q  [BUZZER_MAS806Q]
N12  NMOS-SOT23  [SOT23]
TP9  TP0  [Testpoint]
TP*  TP*  [Testpoint]

### Ports
RTDS_EN

### Nets
+12: B0.- TP*.1
GND: N12.2(S)
RTDS_EN: N12.1(G) ; port RTDS_EN
NetB0_+: B0.+ N12.3(D) TP9.1

### Library data of the parts
TP9 TP* = Testpoint

## Sheet Safety_2019_V_3_0_Enable.SchDoc
size A
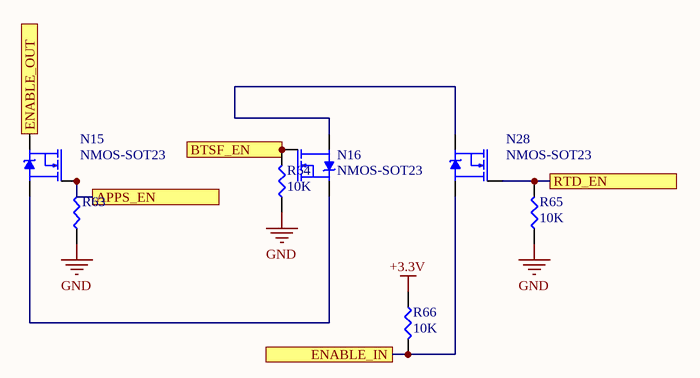
[diagram p9: Safety_2019_V_3_0_Enable.SchDoc]

### Parts
N15  NMOS-SOT23  [SOT23]
N16  NMOS-SOT23  [SOT23]
N28  NMOS-SOT23  [SOT23]
R63  (no value)  [RES-0603]
R64  10K  [RES-0603]
R65  10K  [RES-0603]
R66  10K  [RES-0603]

### Ports
APPS_EN, BTSF_EN, ENABLE_IN, ENABLE_OUT, RTD_EN

### Nets
+3.3V: R66.1
GND: R63.1 R64.1 R65.1
APPS_EN: N15.1(G) R63.2 ; port APPS_EN
BTSF_EN: N16.1(G) R64.2 ; port BTSF_EN
ENABLE_IN: N28.2(S) R66.2 ; port ENABLE_IN
ENABLE_OUT: N15.3(D) ; port ENABLE_OUT
RTD_EN: N28.1(G) R65.2 ; port RTD_EN
NetN15_2: N15.2(S) N16.3(D)
NetN16_2: N16.2(S) N28.3(D)

### Library data of the parts
R63-R66 = RES-0603

## Sheet Safety_2019_V_3_0_TC.SchDoc
size A
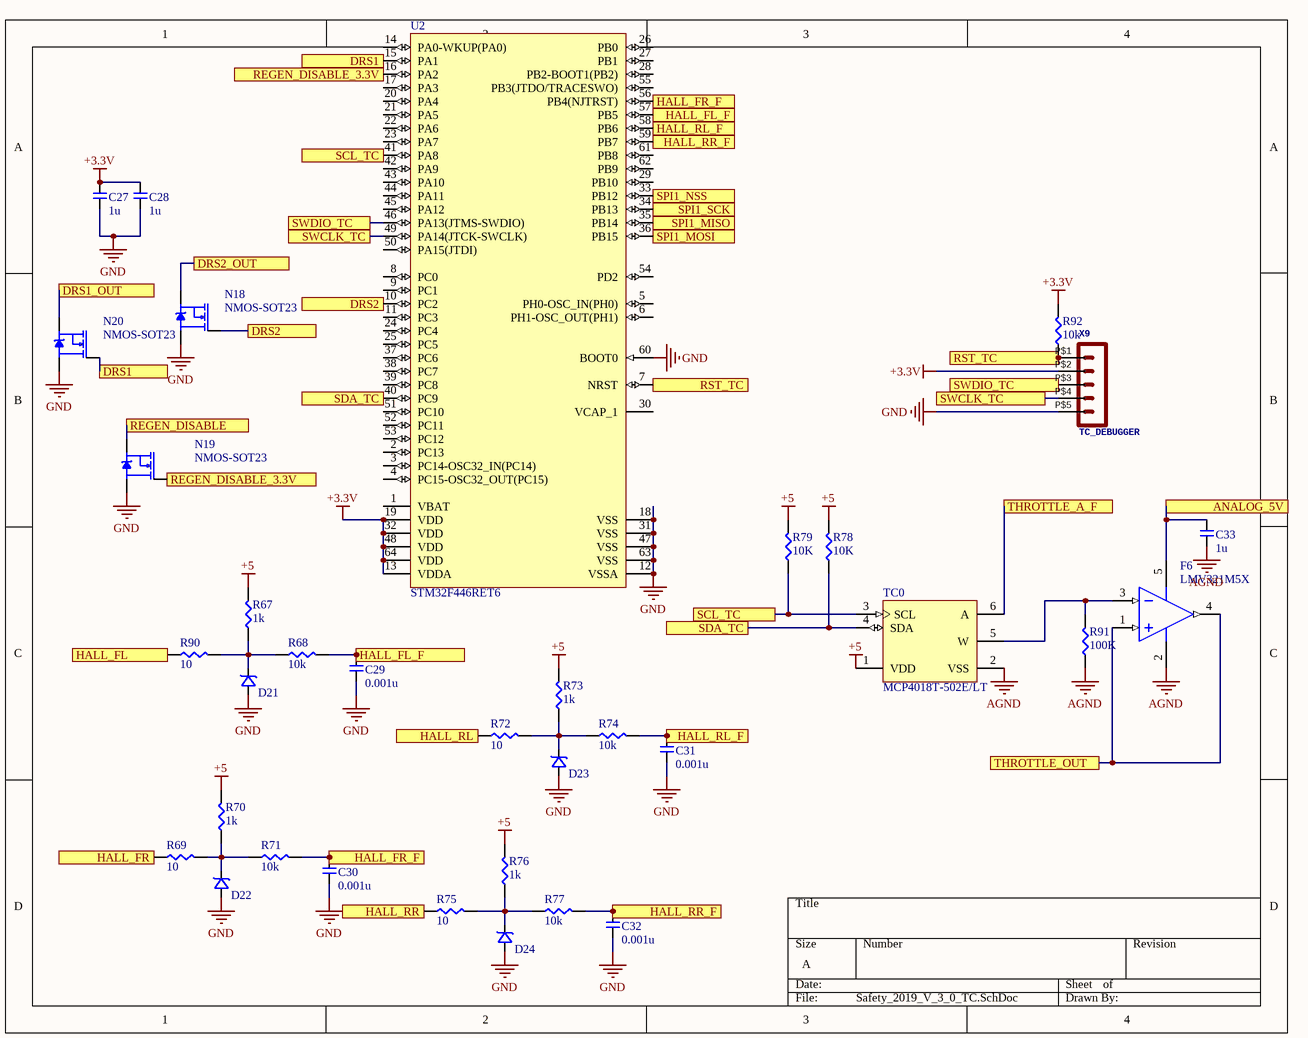
[diagram p10: Safety_2019_V_3_0_TC.SchDoc]

### Parts
C27  1u  [CAP-0603]
C28  1u  [CAP-0603]
C29  0.001u  [CAP-0603]
C30  0.001u  [CAP-0603]
C31  0.001u  [CAP-0603]
C32  0.001u  [CAP-0603]
C33  1u  [CAP-0603]
D21  BZT52C5V6  [SMB]  (value not drawn)
D22  BZT52C5V6  [SMB]  (value not drawn)
D23  BZT52C5V6  [SMB]  (value not drawn)
D24  BZT52C5V6  [SMB]  (value not drawn)
F6  LMV321M5X  [MF05A_N]
N18  NMOS-SOT23  [SOT23]
N19  NMOS-SOT23  [SOT23]
N20  NMOS-SOT23  [SOT23]
R67  1k  [RES-0603]
R68  10k  [RES-0603]
R69  10  [RES-0603]
R70  1k  [RES-0603]
R71  10k  [RES-0603]
R72  10  [RES-0603]
R73  1k  [RES-0603]
R74  10k  [RES-0603]
R75  10  [RES-0603]
R76  1k  [RES-0603]
R77  10k  [RES-0603]
R78  10K  [RES-0603]
R79  10K  [RES-0603]
R90  10  [RES-0603]
R91  100K  [RES-0603]
R92  10k  [RES-0603]
TC0  MCP4018T-502E/LT  [SC70-LT6_L]
U2  STM32F446RET6  [STM-LQFP64_L]
X9  TC_DEBUGGER  [POS5_254MM_MALE]

### Ports
ANALOG_5V, DRS1, DRS1_OUT, DRS2, DRS2_OUT, HALL_FL, HALL_FL_F, HALL_FR, HALL_FR_F, HALL_RL, HALL_RL_F, HALL_RR, HALL_RR_F, REGEN_DISABLE, REGEN_DISABLE_3.3V, RST_TC, SCL_TC, SDA_TC, SPI1_MISO, SPI1_MOSI, SPI1_NSS, SPI1_SCK, SWCLK_TC, SWDIO_TC, THROTTLE_A_F, THROTTLE_OUT

### Nets
+3.3V: C27.2 C28.2 R92.2 U2.13(VDDA) U2.19(VDD) U2.32(VDD) U2.48(VDD) U2.64(VDD) X9.P$2
+5: R67.2 R70.2 R73.2 R76.2 R78.2 R79.2 TC0.1(VDD)
AGND: C33.1 F6.2(V-) R91.1 TC0.2(VSS)
GND: C27.1 C28.1 C29.1 C30.1 C31.1 C32.1 D21.A D22.A D23.A D24.A N18.2(S) N19.2(S) N20.2(S) U2.12(VSSA) U2.18(VSS) U2.31(VSS) U2.47(VSS) U2.60(BOOT0) U2.63(VSS) X9.P$5
ANALOG_5V: C33.2 F6.5(V+) ; port ANALOG_5V
DRS1: N20.1(G) U2.15(PA1) ; port DRS1
DRS1_OUT: N20.3(D) ; port DRS1_OUT
DRS2: N18.1(G) U2.10(PC2) ; port DRS2
DRS2_OUT: N18.3(D) ; port DRS2_OUT
HALL_FL: R90.1 ; port HALL_FL
HALL_FL_F: C29.2 R68.2 U2.57(PB5) ; port HALL_FL_F
HALL_FR: R69.1 ; port HALL_FR
HALL_FR_F: C30.2 R71.2 U2.56(PB4(NJTRST)) ; port HALL_FR_F
HALL_RL: R72.1 ; port HALL_RL
HALL_RL_F: C31.2 R74.2 U2.58(PB6) ; port HALL_RL_F
HALL_RR: R75.1 ; port HALL_RR
HALL_RR_F: C32.2 R77.2 U2.59(PB7) ; port HALL_RR_F
REGEN_DISABLE: N19.3(D) ; port REGEN_DISABLE
REGEN_DISABLE_3.3V: N19.1(G) U2.16(PA2) ; port REGEN_DISABLE_3.3V
RST_TC: R92.1 U2.7(NRST) X9.P$1 ; port RST_TC
SCL_TC: R79.1 TC0.3(SCL) U2.41(PA8) ; port SCL_TC
SDA_TC: R78.1 TC0.4(SDA) U2.40(PC9) ; port SDA_TC
SPI1_MISO: U2.35(PB14) ; port SPI1_MISO
SPI1_MOSI: U2.36(PB15) ; port SPI1_MOSI
SPI1_NSS: U2.33(PB12) ; port SPI1_NSS
SPI1_SCK: U2.34(PB13) ; port SPI1_SCK
SWCLK_TC: U2.49(PA14(JTCK-SWCLK)) X9.P$4 ; port SWCLK_TC
SWDIO_TC: U2.46(PA13(JTMS-SWDIO)) X9.P$3 ; port SWDIO_TC
THROTTLE_A_F: TC0.6(A) ; port THROTTLE_A_F
THROTTLE_OUT: F6.1(IN+) F6.4(OUT) ; port THROTTLE_OUT
NetD21_K: D21.K R67.1 R68.1 R90.2
NetD22_K: D22.K R69.2 R70.1 R71.1
NetD23_K: D23.K R72.2 R73.1 R74.1
NetD24_K: D24.K R75.2 R76.1 R77.1
NetF6_3: F6.3(IN-) R91.2 TC0.5(W)

Not connected (* = marked no-connect by the designer): U2 1(VBAT) 2(PC13) 3(PC14-OSC32_IN(PC14)) 4(PC15-OSC32_OUT(PC15)) 5(PH0-OSC_IN(PH0)) 6(PH1-OSC_OUT(PH1)) 8(PC0) 9(PC1) 11(PC3) 14(PA0-WKUP(PA0)) 17(PA3) 20(PA4) 21(PA5) 22(PA6) 23(PA7) 24(PC4) 25(PC5) 26(PB0) 27(PB1) 28(PB2-BOOT1(PB2)) 29(PB10) 30(VCAP_1) 37(PC6) 38(PC7) 39(PC8) 42(PA9) 43(PA10) 44(PA11) 45(PA12) 50(PA15(JTDI)) 51(PC10) 52(PC11) 53(PC12) 54(PD2) 55(PB3(JTDO/TRACESWO)) 61(PB8) 62(PB9)

### Library data of the parts
C27-C33 = CAP-0603
D21-D24 = DIODE-SMB
F6 = CMP-0055-01048-2: as F0 on sheet Safety_2019_V_3_0_Connector_Filter; ComponentLink2URL: http://www.national.com/pf/LM/LMV321.html; ComponentLink1Description: LMV321 Datasheet; PackageReference: MF05A; ComponentLink3Description: MF05A Package Page; ComponentLink2Description: LMV321 Web Page; CompType: Amplifiers; ComponentLink1URL: http://www.national.com/ds/LM/LMV321.pdf; ComponentLink3URL: http://www.national.com/packaging/folders/mf05a.html; PinCount: 5; PackageDescription: Molded SOT-23, .115 x .063 x .040 in Body, 5 Lead, .0375 in Pitch; PackageVersion: revD, Aug-2008; RevisionNote: Component URLs added; DatasheetVersion: Sep-2009; RoHS: N
R67-R79 R90-R92 = RES-0603
TC0 = CMP-0188-00771-2: 7-Bit Single I2C Digital POT with Volatile Memory, 6-pin SC70, Extended Temperature, Tape and Reel; PackageDescription: 6-Lead Plastic Small Outline Transistor (LT) [SC70]; DatasheetVersion: revA, Mar-2009; ComponentLink1URL: http://www.microchip.com/; ComponentLink1Description: Manufacturer URL; ComponentLink3Description: Package Specification; ComponentLink3URL: http://www.microchip.com/stellent/groups/techpub_sg/documents/packagingspec/en012702.pdf; ComponentLink2Description: Datasheet; PackageVersion: revBB, Aug-2009; ComponentLink2URL: http://ww1.microchip.com/downloads/en/DeviceDoc/22147a.pdf; PackageReference: SC70-LT6; RevisionNote: URLs added.
U2 = CMP-0243-00218-1: ARM Cortex-M4 32-bit MCU+FPU, 512 KB Flash, 128 KB Internal RAM, 50 I/Os, 64-Pin LQFP, -40 to 85 degC, Tray; I/Os (High Current): 50; Supply Voltage(Vcc) min (V): 1.7; Operating Frequency(F) (Processor speed) (MHz): 180; D/A Converter: 2; Internal RAM Size (kB): 128; FLASH Size (Prog) (kB): 512; Core: ARM Cortex-M4; ComponentLink1Description: Manufacturer URL; Package Reference: 64-Pin Low-profile Quad Flat Package, Body 10 x 10 mm, Pitch 0.5 mm; ComponentLink2URL: http://www.st.com/st-web-ui/static/active/en/resource/technical/document/datasheet/DM00141306.pdf; Packing: Tray; DatasheetVersion: Rev. 6; ComponentLink1URL: http://www.st.com/; ComponentLink2Description: Datasheet; Package Description: LQFP64; Mounting Technology: Surface Mount
X9 = POS5_254MM_MALE: as XTC on sheet Safety_2019_V_3_0_uController; LibraryName: MOLEX Micro-Fit; Package: 43650-0524

## Nets that join several sheets
+3.3V: Safety_2019_V_3_0_uController (9 pins), Safety_2019_V_3_0_Faults (R5.2 R6.2 R7.2), Safety_2019_V_3_0_TSAL (U6.5), Safety_2019_V_3_0_Power_IC's (C86.2 PIC0.2 PIC0.4 R24.2), Safety_2019_V_3_0_Connector_Filter (R62.2), Safety_2019_V_3_0_Enable (R66.1), Safety_2019_V_3_0_TC (9 pins)
+5: Safety_2019_V_3_0_uController (IC0.3), Safety_2019_V_3_0_BSPD (17 pins), Safety_2019_V_3_0_Power_IC's (C88.2 PIC1.2 PIC1.4 R25.2), Safety_2019_V_3_0_Connectors (TSAL_POWER.1), Safety_2019_V_3_0_Connector_Filter (6 pins), Safety_2019_V_3_0_TC (7 pins)
+12: Safety_2019_V_3_0_Faults (7 pins), Safety_2019_V_3_0_BSPD (R44.1), Safety_2019_V_3_0_Power_IC's (5 pins), Safety_2019_V_3_0_Connectors (PWR.1), Safety_2019_V_3_0_RTDS (B0.- TP*.1)
AGND: Safety_2019_V_3_0_Connectors (INUDC1.2 XANALOG2.2), Safety_2019_V_3_0_TC (C33.1 F6.2 R91.1 TC0.2)
GND: Safety_2019_V_3_0_uController (14 pins), Safety_2019_V_3_0_Faults (15 pins), Safety_2019_V_3_0_BSPD (22 pins), Safety_2019_V_3_0_BRAKE_LIGHT (N8.3), Safety_2019_V_3_0_TSAL (5 pins), Safety_2019_V_3_0_Power_IC's (9 pins), Safety_2019_V_3_0_Connectors (INUDC1.1 PWR.2 TSAL_POWER.2), Safety_2019_V_3_0_Connector_Filter (36 pins), Safety_2019_V_3_0_RTDS (N12.2), Safety_2019_V_3_0_Enable (R63.1 R64.1 R65.1), Safety_2019_V_3_0_TC (20 pins)
AIR_IN: Safety_2019_V_3_0_Faults (BSPD_RELAY.9), Safety_2019_V_3_0_Connectors (AIR.2)
AIR_OUT: Safety_2019_V_3_0_Faults (RE2.8), Safety_2019_V_3_0_Connectors (AIR.1)
ANALOG_5V: Safety_2019_V_3_0_Connectors (XANALOG2.1), Safety_2019_V_3_0_TC (C33.2 F6.5)
APPS_EN: Safety_2019_V_3_0_uController (U0.40), Safety_2019_V_3_0_Connectors (TP1.1), Safety_2019_V_3_0_Enable (N15.1 R63.2)
BRAKE_LIGHT: Safety_2019_V_3_0_BRAKE_LIGHT (N8.2), Safety_2019_V_3_0_Connectors (?.2)
BRAKE_LIGHT_EN: Safety_2019_V_3_0_uController (U0.26), Safety_2019_V_3_0_BRAKE_LIGHT (R21.1)
BRAKE_POS: Safety_2019_V_3_0_Connectors (POSITIONS.2), Safety_2019_V_3_0_Connector_Filter (R46.1)
BRAKE_POS_F_3_3: Safety_2019_V_3_0_uController (U0.10), Safety_2019_V_3_0_Connector_Filter (R48.1 R49.2)
BRAKE_PRESSURE_1: Safety_2019_V_3_0_Connectors (X12.2), Safety_2019_V_3_0_Connector_Filter (R34.1)
BRAKE_PRESSURE_2: Safety_2019_V_3_0_Connectors (X12.3), Safety_2019_V_3_0_Connector_Filter (R38.1)
BRAKE_PRESSURE_F_1: Safety_2019_V_3_0_BSPD (COMP1.3 COMP1.6 COMP2.6), Safety_2019_V_3_0_Connector_Filter (F2.3 F2.4 R36.2)
BRAKE_PRESSURE_F_1_3_3: Safety_2019_V_3_0_uController (U0.13), Safety_2019_V_3_0_Connector_Filter (R36.1 R37.2)
BRAKE_PRESSURE_F_2_3_3: Safety_2019_V_3_0_uController (U0.12), Safety_2019_V_3_0_Connector_Filter (R40.1 R41.2)
BTSF_EN: Safety_2019_V_3_0_uController (U0.45), Safety_2019_V_3_0_Connectors (TP2.1), Safety_2019_V_3_0_Enable (N16.1 R64.2)
CAN_H: Safety_2019_V_3_0_uController (D1.1 IC0.7 R3.2 R4.1), Safety_2019_V_3_0_Connectors (CAN.2)
CAN_L: Safety_2019_V_3_0_uController (D1.2 IC0.6 R4.2 R80.2), Safety_2019_V_3_0_Connectors (CAN.1)
CURRENT_SENSE: Safety_2019_V_3_0_BSPD (R16.1 R17.2), Safety_2019_V_3_0_Connectors (X12.1)
DRS1_OUT: Safety_2019_V_3_0_Connectors (X11.1), Safety_2019_V_3_0_TC (N20.3)
DRS2_OUT: Safety_2019_V_3_0_Connectors (X11.2), Safety_2019_V_3_0_TC (N18.3)
ENABLE_IN: Safety_2019_V_3_0_uController (U0.28), Safety_2019_V_3_0_Connectors (ENABLES.1), Safety_2019_V_3_0_Enable (N28.2 R66.2)
ENABLE_OUT: Safety_2019_V_3_0_Connectors (ENABLES.2), Safety_2019_V_3_0_Enable (N15.3)
FAULT_BMS: Safety_2019_V_3_0_Faults (C85.2 N1.1), Safety_2019_V_3_0_Connectors (X6.3), Safety_2019_V_3_0_Connector_Filter (R52.1)
FAULT_BMS_STAT: Safety_2019_V_3_0_Faults (8 pins), Safety_2019_V_3_0_Connectors (TP21.1)
FAULT_BMS_STATUS: Safety_2019_V_3_0_uController (U0.4), Safety_2019_V_3_0_Faults (N4.3 R6.1)
FAULT_BSPD: Safety_2019_V_3_0_Faults (C84.2 N0.1), Safety_2019_V_3_0_BSPD (N6.3 N7.3 R44.2)
FAULT_BSPD_STAT: Safety_2019_V_3_0_Faults (8 pins), Safety_2019_V_3_0_Connectors (TP4.1)
FAULT_BSPD_STATUS: Safety_2019_V_3_0_uController (U0.5), Safety_2019_V_3_0_Faults (N3.3 R5.1)
FAULT_IMD: Safety_2019_V_3_0_Faults (C82.2 N2.1), Safety_2019_V_3_0_Connectors (X6.2), Safety_2019_V_3_0_Connector_Filter (R54.1)
FAULT_IMD_STAT: Safety_2019_V_3_0_Faults (8 pins), Safety_2019_V_3_0_Connectors (TP5.1)
FAULT_IMD_STATUS: Safety_2019_V_3_0_uController (U0.3), Safety_2019_V_3_0_Faults (N5.3 R7.1)
FAULT_RESET: Safety_2019_V_3_0_Connectors (X6.1), Safety_2019_V_3_0_Connector_Filter (R50.1)
FAULT_RESET_F: Safety_2019_V_3_0_Faults (P0.1 P1.1 P2.1 Reset.2), Safety_2019_V_3_0_Connector_Filter (C23.2 R51.2)
HALL_FL: Safety_2019_V_3_0_Connectors (HALL_EFFECTS.3), Safety_2019_V_3_0_TC (R90.1)
HALL_FR: Safety_2019_V_3_0_Connectors (HALL_EFFECTS.4), Safety_2019_V_3_0_TC (R69.1)
HALL_RL: Safety_2019_V_3_0_Connectors (HALL_EFFECTS.1), Safety_2019_V_3_0_TC (R72.1)
HALL_RR: Safety_2019_V_3_0_Connectors (HALL_EFFECTS.2), Safety_2019_V_3_0_TC (R75.1)
HV_CONNECTED_3_3: Safety_2019_V_3_0_uController (U0.21), Safety_2019_V_3_0_TSAL (R?.1)
PRECHARGE_COMPLETE: Safety_2019_V_3_0_Connectors (?.1), Safety_2019_V_3_0_Connector_Filter (R56.1)
PRECHARGE_COMPLETE_3_3: Safety_2019_V_3_0_uController (U0.42), Safety_2019_V_3_0_Connector_Filter (N13.3 R62.1)
REGEN_DISABLE: Safety_2019_V_3_0_Connectors (X11.3), Safety_2019_V_3_0_TC (N19.3)
RTD_EN: Safety_2019_V_3_0_uController (U0.41), Safety_2019_V_3_0_Connectors (TP3.1), Safety_2019_V_3_0_Enable (N28.1 R65.2)
RTDS_EN: Safety_2019_V_3_0_uController (U0.39), Safety_2019_V_3_0_RTDS (N12.1)
SPI1_MISO: Safety_2019_V_3_0_uController (U0.16), Safety_2019_V_3_0_TC (U2.35)
SPI1_MOSI: Safety_2019_V_3_0_uController (U0.17), Safety_2019_V_3_0_TC (U2.36)
SPI1_NSS: Safety_2019_V_3_0_uController (U0.14), Safety_2019_V_3_0_TC (U2.33)
SPI1_SCK: Safety_2019_V_3_0_uController (U0.15), Safety_2019_V_3_0_TC (U2.34)
STEERING_POS: Safety_2019_V_3_0_Connectors (POSITIONS.1), Safety_2019_V_3_0_Connector_Filter (R42.1)
STEERING_POS_F_3_3: Safety_2019_V_3_0_uController (U0.11), Safety_2019_V_3_0_Connector_Filter (R45.2 R81.1)
THROTTLE_A: Safety_2019_V_3_0_Connectors (THROTTLES.2), Safety_2019_V_3_0_Connector_Filter (R26.1)
THROTTLE_A_F: Safety_2019_V_3_0_Connector_Filter (F0.3 F0.4 R28.2), Safety_2019_V_3_0_TC (TC0.6)
THROTTLE_A_F_3_3: Safety_2019_V_3_0_uController (U0.18), Safety_2019_V_3_0_Connector_Filter (R28.1 R29.2)
THROTTLE_B: Safety_2019_V_3_0_Connectors (THROTTLES.1), Safety_2019_V_3_0_Connector_Filter (R30.1)
THROTTLE_B_F_3_3: Safety_2019_V_3_0_uController (U0.19), Safety_2019_V_3_0_Connector_Filter (R32.1 R33.2)
THROTTLE_OUT: Safety_2019_V_3_0_Connectors (XANALOG2.3), Safety_2019_V_3_0_TC (F6.1 F6.4)
TSAL_EN: Safety_2019_V_3_0_TSAL (R22.2), Safety_2019_V_3_0_Connectors (?.5)
TSAL_HV: Safety_2019_V_3_0_TSAL (N10.3), Safety_2019_V_3_0_Connectors (?.4)
TSAL_LV: Safety_2019_V_3_0_TSAL (N11.3), Safety_2019_V_3_0_Connectors (?.3)